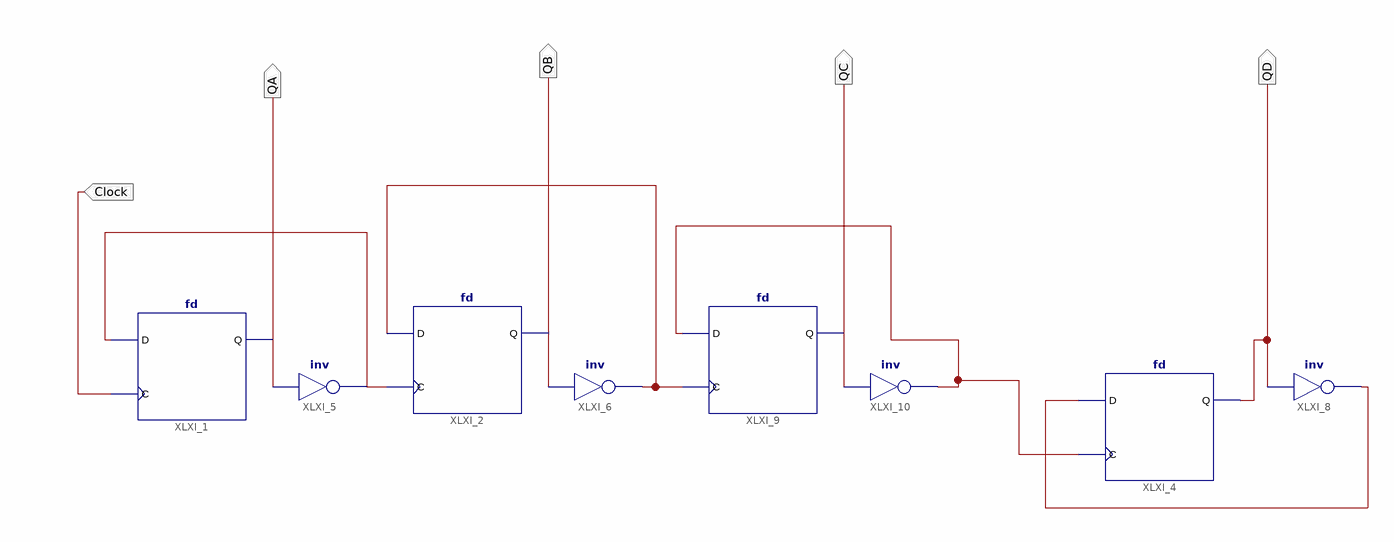
[diagram p0: schematic sheet 1]
// Xilinx ISE schematic data_counter.sch (spartan3a) as structural Verilog: 8 symbols, 5 ports
module data_counter (
  input  Clock,
  output QB,
  output QA,
  output QD,
  output QC
);

  wire XLXN_8, XLXN_9, XLXN_14, XLXN_15;

  fd XLXI_1 (.C(Clock), .D(XLXN_14), .Q(QA));
  fd XLXI_2 (.C(XLXN_14), .D(XLXN_15), .Q(QB));
  not XLXI_5 (XLXN_14, QA);
  not XLXI_6 (XLXN_15, QB);
  fd XLXI_4 (.C(XLXN_9), .D(XLXN_8), .Q(QD));
  not XLXI_8 (XLXN_8, QD);
  fd XLXI_9 (.C(XLXN_15), .D(XLXN_9), .Q(QC));
  not XLXI_10 (XLXN_9, QC);
endmodule
